# EAGLE design aquaponics (EAGLE 7.2.0)
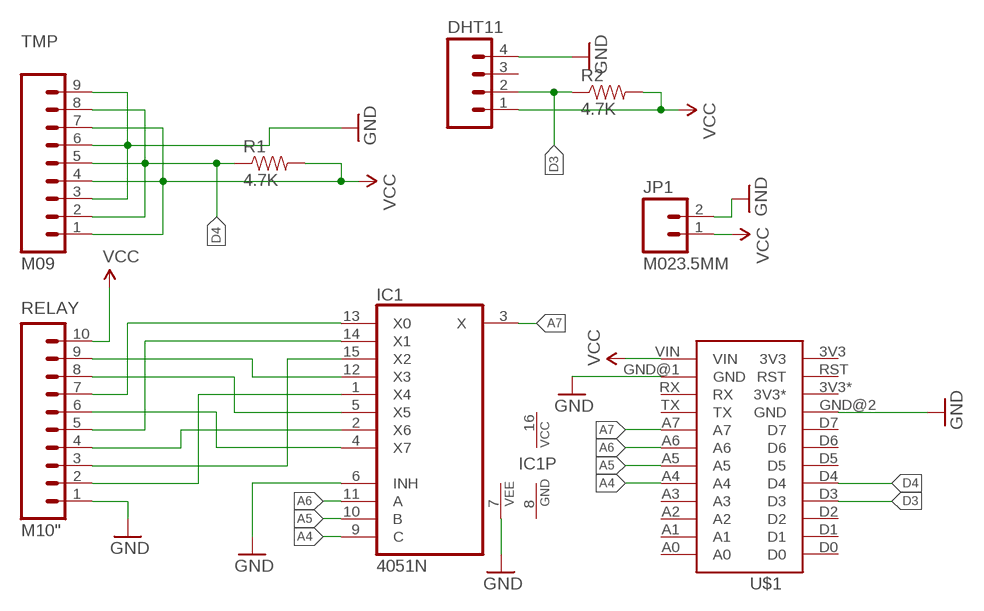
[diagram p0: schematic, sheet 1]

## Parts
DHT11  M04PTH  [1X04]
IC1  4051N  [DIL16]
JP1  M023.5MM  [SCREWTERMINAL-3.5MM-2]
R1  4.7K  RESISTOR1206  [1206]
R2  4.7K  RESISTOR1206  [1206]
RELAY  M10"  [1X10]
TMP  M09  [1X09]
U$1  SPARKCORE  [SPARKCORE]

## Nets
A4: IC1.9(C) U$1.A4
A5: IC1.10(B) U$1.A5
A6: IC1.11(A) U$1.A6
A7: IC1.3(X) U$1.A7
D3: DHT11.2 R2.1 U$1.D3
D4: R1.1 TMP.2 TMP.5 TMP.8 U$1.D4
GND: DHT11.4 IC1.6(INH) IC1.7(VEE) JP1.2 RELAY.1 TMP.3 TMP.6 TMP.9 U$1.GND@1(GND) U$1.GND@2(GND)
N$1: IC1.4(X7) RELAY.6
N$2: IC1.2(X6) RELAY.4
N$3: IC1.15(X2) RELAY.3
N$4: IC1.1(X4) RELAY.2
N$5: IC1.14(X1) RELAY.5
N$6: IC1.13(X0) RELAY.7
N$7: IC1.5(X5) RELAY.8
N$8: IC1.12(X3) RELAY.9
VCC: DHT11.1 JP1.1 R1.2 R2.2 RELAY.10 TMP.1 TMP.4 TMP.7 U$1.VIN
Unconnected: DHT11.3 U$1.3V3 U$1.3V3* U$1.A0 U$1.A1 U$1.A2 U$1.A3 U$1.D0 U$1.D1 U$1.D2 U$1.D5 U$1.D6 U$1.D7 U$1.RST U$1.RX U$1.TX

## Power pins joined to a net without a drawn wire
GND: IC1.8(GND)
VCC: IC1.16(VCC)

## Library data of the parts
DHT11 = SparkFun-Connectors:M04: Header 4 Standard 4-pin 0.1" header. Use with straight break away headers (SKU : PRT-00116), right angle break away headers (PRT-00553), swiss pins (PRT-00743), machine pins (PRT-00117), and female headers (PRT-00115). Molex polarized connector foot print use with SKU : PRT-08231 with associated crimp pins and housings. 1MM SMD Version SKU: PRT-10208
IC1 = 40xx:4051: 8-channel ANALOG MULTIPLEXER
JP1 = SparkFun-Connectors:M02: Standard 2-pin 0.1" header. Use with - straight break away headers ( PRT-00116) - right angle break away headers (PRT-00553) - swiss pins (PRT-00743) - machine pins (PRT-00117) - female headers (PRT-00115) Molex polarized connector foot print use with: PRT-08233 with associated crimp pins and housings. 2.54_SCREWTERM for use with PRT-10571. 3.5mm Screw Terminal footprints for PRT-08084 5mm Screw Terminal footprints for use with PRT-08432
R1 R2 = SparkFun-Passives:RESISTOR: Resistor Basic schematic elements and footprints for 0603, 1206, and PTH resistors.
RELAY = SparkFun-Connectors:M10: Header 10 Standard 10-pin 0.1" header. Use with straight break away headers (SKU : PRT-00116), right angle break away headers (PRT-00553), swiss pins (PRT-00743), machine pins (PRT-00117), and female headers (PRT-00115).
TMP = SparkFun-Connectors:M09: Header 9 Standard 9-pin 0.1" header. Use with straight break away headers (SKU : PRT-00116), right angle break away headers (PRT-00553), swiss pins (PRT-00743), machine pins (PRT-00117), and female headers (PRT-00115).
U$1 = petrocik:SPARKCORE

## Board
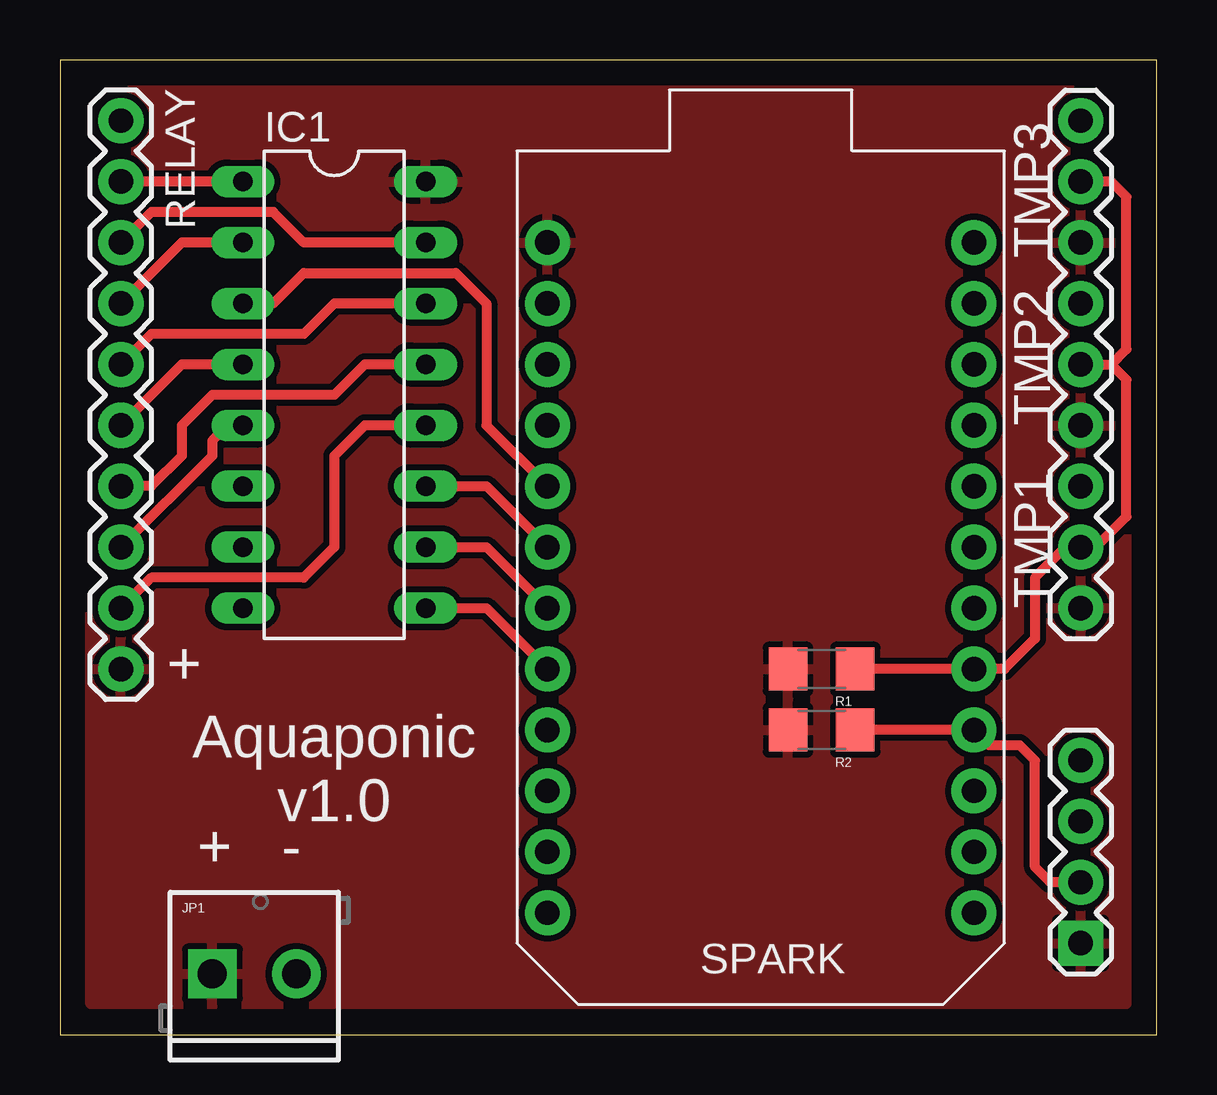
[diagram p1: board, top side]
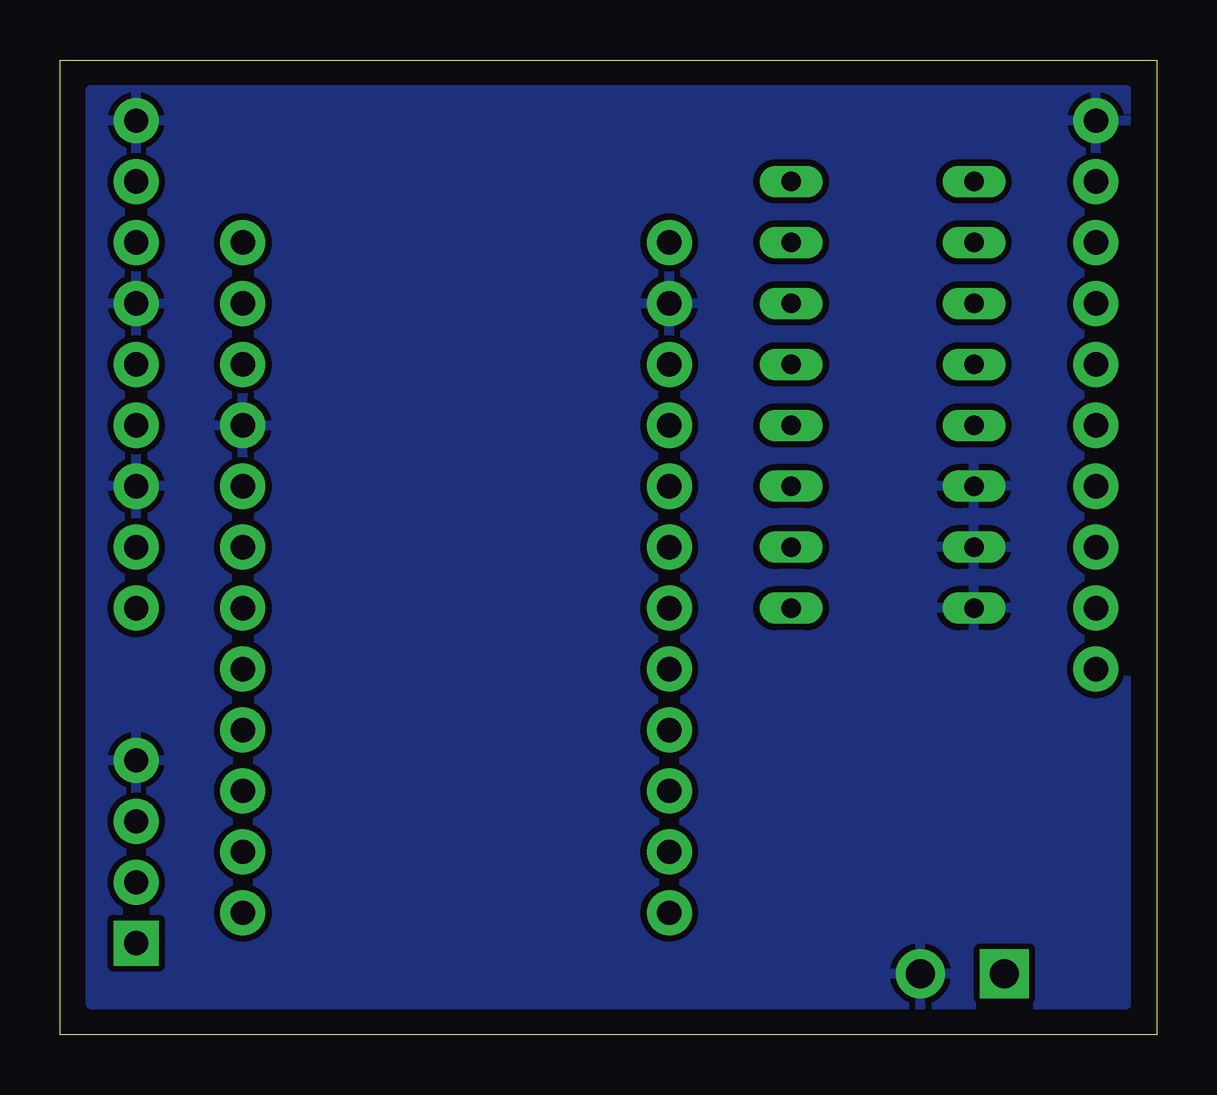
[diagram p2: board, bottom side, seen from below]

Size 45.72 x 40.63 mm. Coordinates in mm from the lower left corner, seen from the top.
Outline: 0,0 45.72,0 45.72,40.63 0,40.63 0,0
Copper layers (1*16): Top 0.035mm / dielectric 1.5mm / Bottom 0.035mm
Design rules "default": minimum track width 10mil, minimum drill 24mil, track to track 8mil, track to pad 8mil, pad to pad 8mil, via to via 8mil, smd to smd 8mil, copper to edge 40mil, drill to drill 8mil, minimum pad ring 10mil, minimum via ring 8mil, stop-mask expansion 4mil, vias tented up to drill 0mil, thermal gap 10mil

### Footprints (pad centres in the part's own frame; a part is rotated, then mirrored left to right if it is on the bottom)
1X04 = drill 1.016 pad 1.88 square: 1 0,0 | drill 1.016 pad 1.88: 2 2.54,0; 3 5.08,0; 4 7.62,0
DIL16 = drill 0.813 long: 1 -8.89,-3.81; 2 -6.35,-3.81; 3 -3.81,-3.81; 4 -1.27,-3.81; 5 1.27,-3.81; 6 3.81,-3.81; 7 6.35,-3.81; 8 8.89,-3.81; 9 8.89,3.81; 10 6.35,3.81; 11 3.81,3.81; 12 1.27,3.81; 13 -1.27,3.81; 14 -3.81,3.81; 15 -6.35,3.81; 16 -8.89,3.81
SCREWTERMINAL-3.5MM-2 = drill 1.2 pad 2.032 square: 1 0,0 | drill 1.2 pad 2.032: 2 3.5,0
1206 = smd 1.6 x 1.8: 1 -1.4,0; 2 1.4,0
1X10 = drill 1.016 pad 1.88: 1 0,0; 2 2.54,0; 3 5.08,0; 4 7.62,0; 5 10.16,0; 6 12.7,0; 7 15.24,0; 8 17.78,0; 9 20.32,0; 10 22.86,0
1X09 = drill 1.016 pad 1.88: 1 0,0; 2 2.54,0; 3 5.08,0; 4 7.62,0; 5 10.16,0; 6 12.7,0; 7 15.24,0; 8 17.78,0; 9 20.32,0
SPARKCORE = drill 1.016 pad 1.88: 3V3 8.89,15.24; 3V3* 8.89,10.16; A0 -8.89,-12.7; A1 -8.89,-10.16; A2 -8.89,-7.62; A3 -8.89,-5.08; A4 -8.89,-2.54; A5 -8.89,0; A6 -8.89,2.54; A7 -8.89,5.08; D0 8.89,-12.7; D1 8.89,-10.16; D2 8.89,-7.62; D3 8.89,-5.08; D4 8.89,-2.54; D5 8.89,0; D6 8.89,2.54; D7 8.89,5.08; GND@1 -8.89,12.7; GND@2 8.89,7.62; RST 8.89,12.7; RX -8.89,10.16; TX -8.89,7.62; VIN -8.89,15.24

### Placement (x,y rotation side)
DHT11  42.55,3.81 90 top
IC1  11.43,26.67 270 top
JP1  6.35,2.54 0 top
R1  31.75,15.24 180 top
R2  31.75,12.7 180 top
RELAY  2.54,38.1 270 top
TMP  42.55,17.78 90 top
U$1  29.21,17.78 0 top

### Tracks (layer width: path | path; a pad name or v marks a point on that pad's centre or on a via)
A4
  Top 0.406: IC1.9 17.78,17.78 U$1.A4
A5
  Top 0.406: IC1.10 17.78,20.32 U$1.A5
A6
  Top 0.406: IC1.11 17.78,22.86 U$1.A6
A7
  Top 0.406: IC1.3 8.89,30.48 10.16,31.75 16.51,31.75 17.78,30.48 17.78,25.4 U$1.A7
D3
  Top 0.406: R2.1 U$1.D3 38.73,12.06 40.01,12.06 40.64,11.43 40.64,6.99 41.27,6.35 DHT11.2
D4
  Top 0.254: 33.02,15.24 R1.1
  Top 0.406: R1.1 U$1.D4 39.37,15.24 40.64,16.51 40.64,19.05 41.91,20.32 TMP.2 43.18,20.32 44.45,21.59 44.45,27.3 43.81,27.94 | TMP.5 43.81,27.94 | 43.81,27.94 44.45,28.57 44.45,34.92 43.81,35.56 TMP.8
GND
  pour Bottom (isolate 0.254): 1.27,39.37 44.45,39.37 44.45,1.27 1.27,1.27
N$1
  Top 0.406: IC1.4 5.08,27.94 RELAY.6
N$2
  Top 0.406: IC1.2 5.08,33.02 RELAY.4
N$3
  Top 0.406: IC1.15 10.16,33.02 8.89,34.29 3.81,34.29 RELAY.3
N$4
  Top 0.406: IC1.1 RELAY.2
N$5
  Top 0.406: IC1.14 11.43,30.48 10.16,29.21 3.81,29.21 RELAY.5
N$6
  Top 0.406: IC1.13 12.7,27.94 11.43,26.67 6.35,26.67 5.08,25.4 5.08,24.13 3.81,22.86 RELAY.7
N$7
  Top 0.406: IC1.5 6.99,25.4 6.35,24.77 6.35,24.13 RELAY.8
N$8
  Top 0.406: IC1.12 12.7,25.4 11.43,24.13 11.43,20.32 10.16,19.05 3.81,19.05 RELAY.9
VCC
  pour Top (isolate 0.254): 1.27,39.37 44.45,39.37 44.45,1.27 1.27,1.27

### Text on the board
tPlace: TMP3 | TMP2 | TMP1 | + | Aquaponic / v1.0 | + -